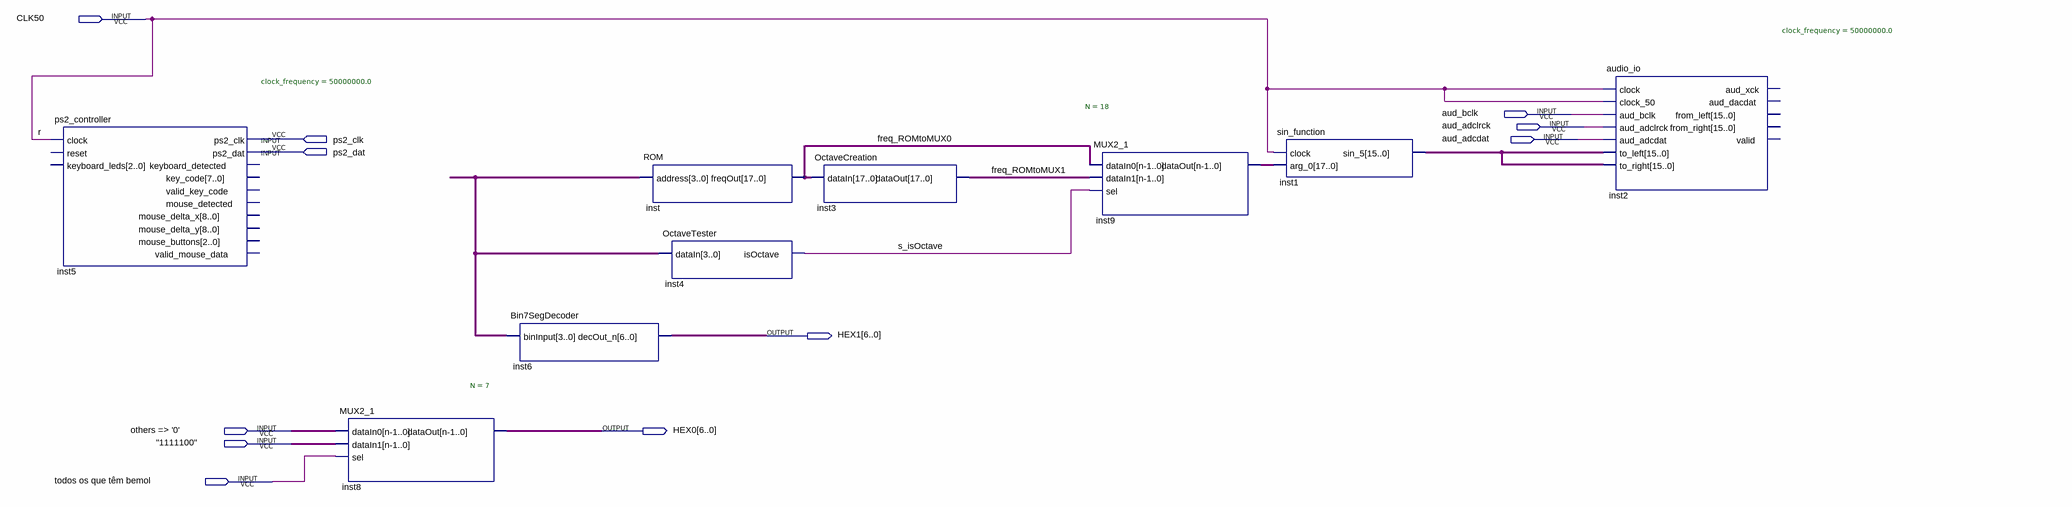
[diagram p0: schematic sheet]
// Quartus schematic DiagramaApoio.bdf as structural Verilog: 9 symbols, 11 pins
module DiagramaApoio (
  input  CLK50,
  input  aud_bclk,
  input  aud_adclrck,
  input  ps2_clk,
  input  aud_adcdat,
  input  ps2_dat,
  input  \others_=>_'0' ,
  input  \"1111100" ,
  input  \todos_os_que_têm_bemol ,
  output [6:0] HEX1,
  output [6:0] HEX0
);

  wire freq_ROMtoMUX0, freq_ROMtoMUX1, s_isOctave;
  wire [3:0] undriven;
  wire [6:0] undriven_2, undriven_3;
  wire [15:0] inst1_sin_5;
  wire [17:0] inst9_dataout;

  ps2_controller #(.clock_frequency(50000000.0)) inst5 (
    .clock(CLK50), .ps2_clk(ps2_clk), .ps2_dat(ps2_dat));  // open: reset, keyboard_leds, keyboard_detected, key_code, valid_key_code, mouse_detected, mouse_delta_x, mouse_delta_y, mouse_buttons, valid_mouse_data
  MUX2_1 #(.N(7)) inst8 (.dataIn0(undriven_2), .dataIn1(undriven_3), .sel(\todos_os_que_têm_bemol ), .dataOut(HEX0));
  Bin7SegDecoder inst6 (.binInput(undriven), .decOut_n(HEX1));
  ROM inst (.address(undriven), .freqOut(freq_ROMtoMUX0));
  OctaveTester inst4 (.dataIn(undriven), .isOctave(s_isOctave));
  OctaveCreation inst3 (.dataIn({18{freq_ROMtoMUX0}}), .dataOut(freq_ROMtoMUX1));
  MUX2_1 #(.N(18)) inst9 (
    .dataIn0({18{freq_ROMtoMUX0}}), .dataIn1({18{freq_ROMtoMUX1}}), .sel(s_isOctave), .dataOut(inst9_dataout));
  sin_function inst1 (.clock(CLK50), .arg_0(inst9_dataout), .sin_5(inst1_sin_5));
  audio_io #(.clock_frequency(50000000.0)) inst2 (
    .clock(CLK50), .clock_50(CLK50), .aud_bclk(aud_bclk), .aud_adclrck(aud_adclrck), .aud_adcdat(aud_adcdat),
    .to_left(inst1_sin_5), .to_right(inst1_sin_5));  // open: aud_xck, aud_dacdat, from_left, from_right, valid

  // Other names for the same wires on the sheet: r = CLK50
endmodule
